# Altium schematic sheet 07-Mechanicals.SchDoc
size A4; DrawnBy: Hussam E; Engineer: Hussam E; SheetNumber: 1
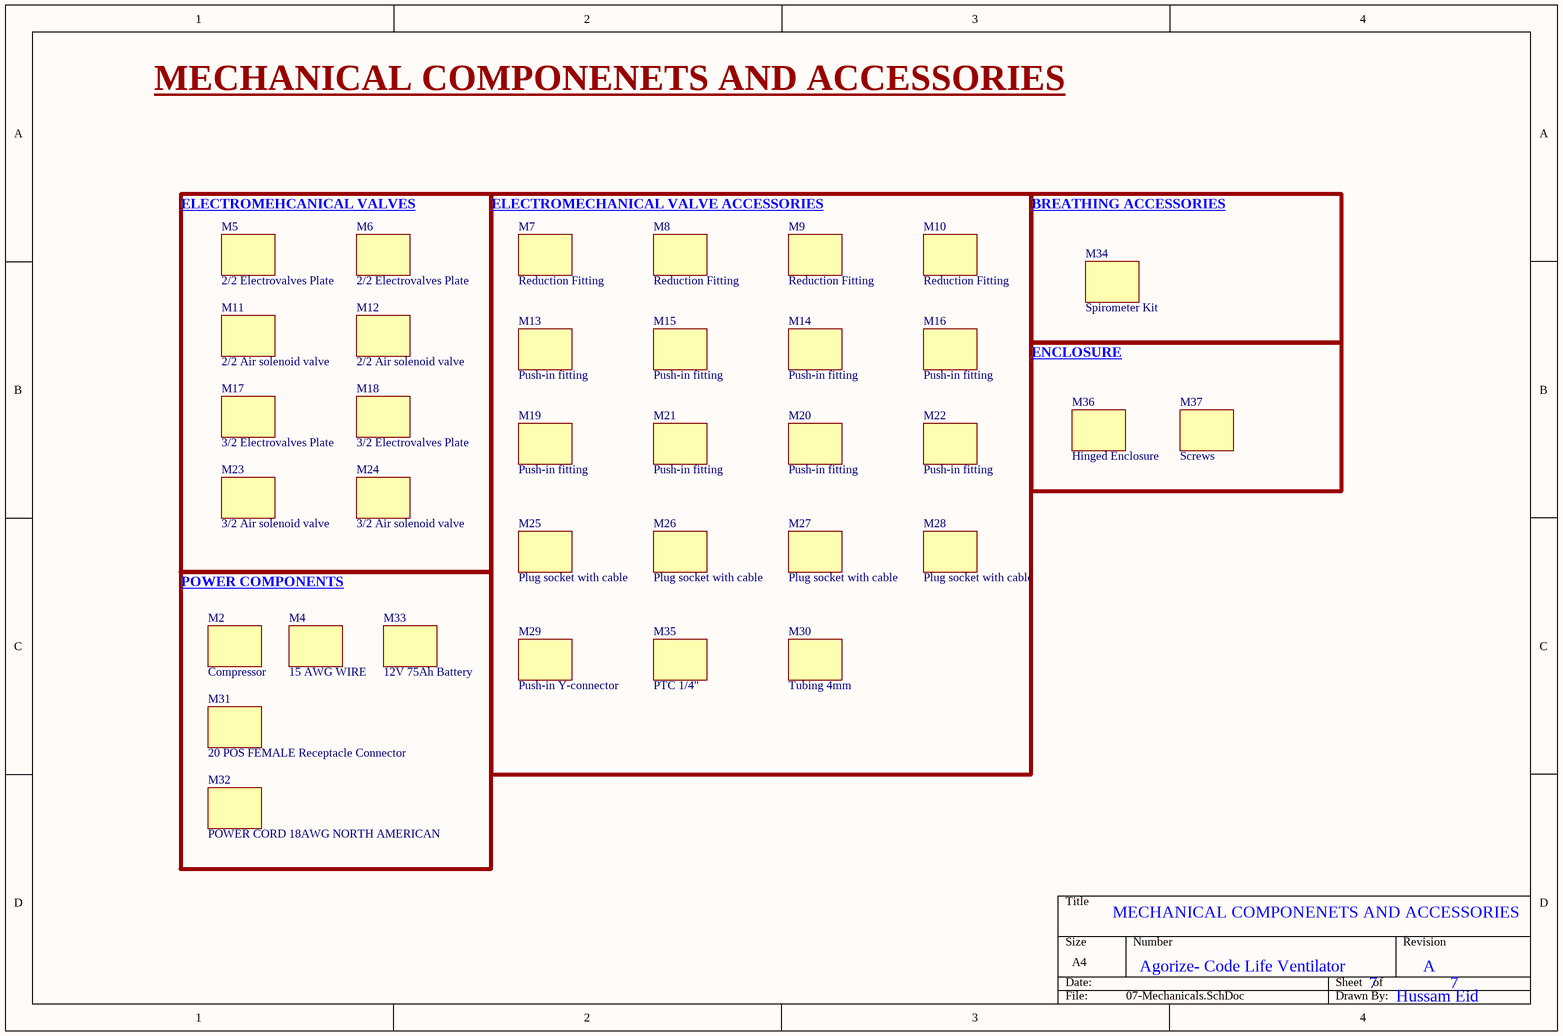
[diagram p0: 07-Mechanicals.SchDoc]

## Parts
M2  Compressor  (mechanical)
M4  15 AWG WIRE  (mechanical)
M5  2/2 Electrovalves Plate  (mechanical)
M6  2/2 Electrovalves Plate  (mechanical)
M7  Reduction Fitting  (mechanical)
M8  Reduction Fitting  (mechanical)
M9  Reduction Fitting  (mechanical)
M10  Reduction Fitting  (mechanical)
M11  2/2 Air solenoid valve  (mechanical)
M12  2/2 Air solenoid valve  (mechanical)
M13  Push-in fitting  (mechanical)
M14  Push-in fitting  (mechanical)
M15  Push-in fitting  (mechanical)
M16  Push-in fitting  (mechanical)
M17  3/2 Electrovalves Plate  (mechanical)
M18  3/2 Electrovalves Plate  (mechanical)
M19  Push-in fitting  (mechanical)
M20  Push-in fitting  (mechanical)
M21  Push-in fitting  (mechanical)
M22  Push-in fitting  (mechanical)
M23  3/2 Air solenoid valve  (mechanical)
M24  3/2 Air solenoid valve  (mechanical)
M25  Plug socket with cable  (mechanical)
M26  Plug socket with cable  (mechanical)
M27  Plug socket with cable  (mechanical)
M28  Plug socket with cable  (mechanical)
M29  Push-in Y-connector  (mechanical)
M30  Tubing 4mm  (mechanical)
M31  20 POS FEMALE Receptacle Connector  (mechanical)
M32  POWER CORD 18AWG NORTH AMERICAN  (mechanical)
M33  12V 75Ah Battery  (mechanical)
M34  Spirometer Kit  (mechanical)
M35  PTC 1/4"  (mechanical)
M36  Hinged Enclosure  (mechanical)
M37  Screws  (mechanical)

## Notes on the sheet
- MECHANICAL COMPONENETS AND ACCESSORIES
- (near M34) BREATHING ACCESSORIES
- ENCLOSURE
- ELECTROMEHCANICAL VALVES
- ELECTROMECHANICAL VALVE ACCESSORIES
- POWER COMPONENTS
- Agorize- Code Life Ventilator
- 7
- A
- Hussam Eid

## Library data of the parts
M2 = Compressor: 15A 60PSI Compressor; Manufacturer 1: McMaster; Manufacturer Part Number 1: 4251K71; Parameter 1: *
M4 = Compressor: HOOK-UP DUAL STRND 20AWG WHT 5'; Manufacturer Part Number 1: 20 AWG WIRE; Manufacturer 1: 81044/12-20-9
M5 M6 = Compressor: Manufacturer_Part_Number: MHP1-AS-2-M3; Manufacturer: Festo; Manufacturer Part Number 1: MHP1-AS-2-M3; Manufacturer 1: Festo
M7-M10 = Compressor: Push-in fitting 1/4mm to 4mm; Manufacturer_Part_Number: QS-1/4-4; Manufacturer_Part_Number_1: 190644; Manufacturer: Festo; Manufacturer Part Number 1: QS-1/4-4; Manufacturer 1: Festo
M11 M12 = Compressor: Manufacturer_Part_Number: MHP1-M4H-2/2G-M3-TC; Manufacturer_Part_Number_1: 197048; Manufacturer: Festo; Manufacturer Part Number 1: MHP1-M4H-2/2G-M3-TC; Manufacturer 1: Festo
M13-M16 M19-M22 = Compressor: Manufacturer_Part_Number: QSM-M3-4-I; Manufacturer_Part_Number_1: 153314; Manufacturer: Festo; Manufacturer Part Number 1: QSM-M3-4-I; Manufacturer 1: Festo
M17 M18 = Compressor: 2/2 Electrovalves Plate; Manufacturer_Part_Number: MHP1-AS-3-M3; Manufacturer: Festo; Manufacturer Part Number 1: MHP1-AS-3-M3; Manufacturer 1: Festo
M23 M24 = Compressor: 2/2 Air solenoid valve /; Manufacturer_Part_Number: MHP1-M4H-3/2GM3-TC; Manufacturer_Part_Number_1: 197048; Manufacturer: Festo; Manufacturer Part Number 1: MHP1-M4H-3/2GM3-TC; Manufacturer 1: Festo
M25-M28 = Compressor: Plug socket with cable for Valves; Manufacturer_Part_Number: KMH-0,5; Manufacturer_Part_Number_1: 197263; Manufacturer: Festo; Manufacturer Part Number 1: KMH-0,5; Manufacturer 1: Festo
M29 = Compressor: Manufacturer_Part_Number: QSY-8-4; Manufacturer_Part_Number_1: 130610; Manufacturer: Festo; Manufacturer Part Number 1: QSY-8-4; Manufacturer 1: Festo
M30 = Compressor: 4mm Plastic Tubing; Manufacturer_Part_Number: PUN-H-4X0,75-BL; Manufacturer_Part_Number_1: 197383; Manufacturer 1: Festo; Manufacturer Part Number 1: PUN-H-4X0,75-BL
M31 = Compressor: CONN RCPT 20POS 0.05 GOLD PCB; Manufacturer Part Number 1: 20021311-00020T4LF; Manufacturer 1: Amphenol ICC (FCI)
M32 = Compressor: CORD 18AWG 5-15P - 320-C13 9.84'; Manufacturer Part Number 1: A-PC2302-030021-1; Manufacturer 1: Assmann WSW Components
M33 = Compressor: Battery 12V 75Ah; Manufacturer 1: Powersonic; Manufacturer Part Number 1: PS-12750S
M34 = Compressor: 22mm Compact, extendable breathing system with luer elbow, 1.5m; Manufacturer_Part_Number: 2150000; Manufacturer 1: Intersurgical; Manufacturer Part Number 1: 2150000
M35 = Compressor: Vixen Air Inflation Schrader Valve with Push to Connect (PTC) for 1/4" OD Air Line; Manufacturer_Part_Number: VXA1014-2; Manufacturer 1: Vixen Air Inflation; Manufacturer Part Number 1: VXA1014-2
M36 = Compressor: WQ-64 NEMA Hinged Enclosure / 14.96 x 11.02 x 5.12 in; Manufacturer 1: PolyCase; Manufacturer Part Number 1: WQ-64
M37 = Compressor: PCB Screws for WH/WQ Series Enclosures / 0.43 x 0.31 x 0.31 in; Manufacturer 1: PolyCase; Manufacturer Part Number 1: SCREWS-007-50